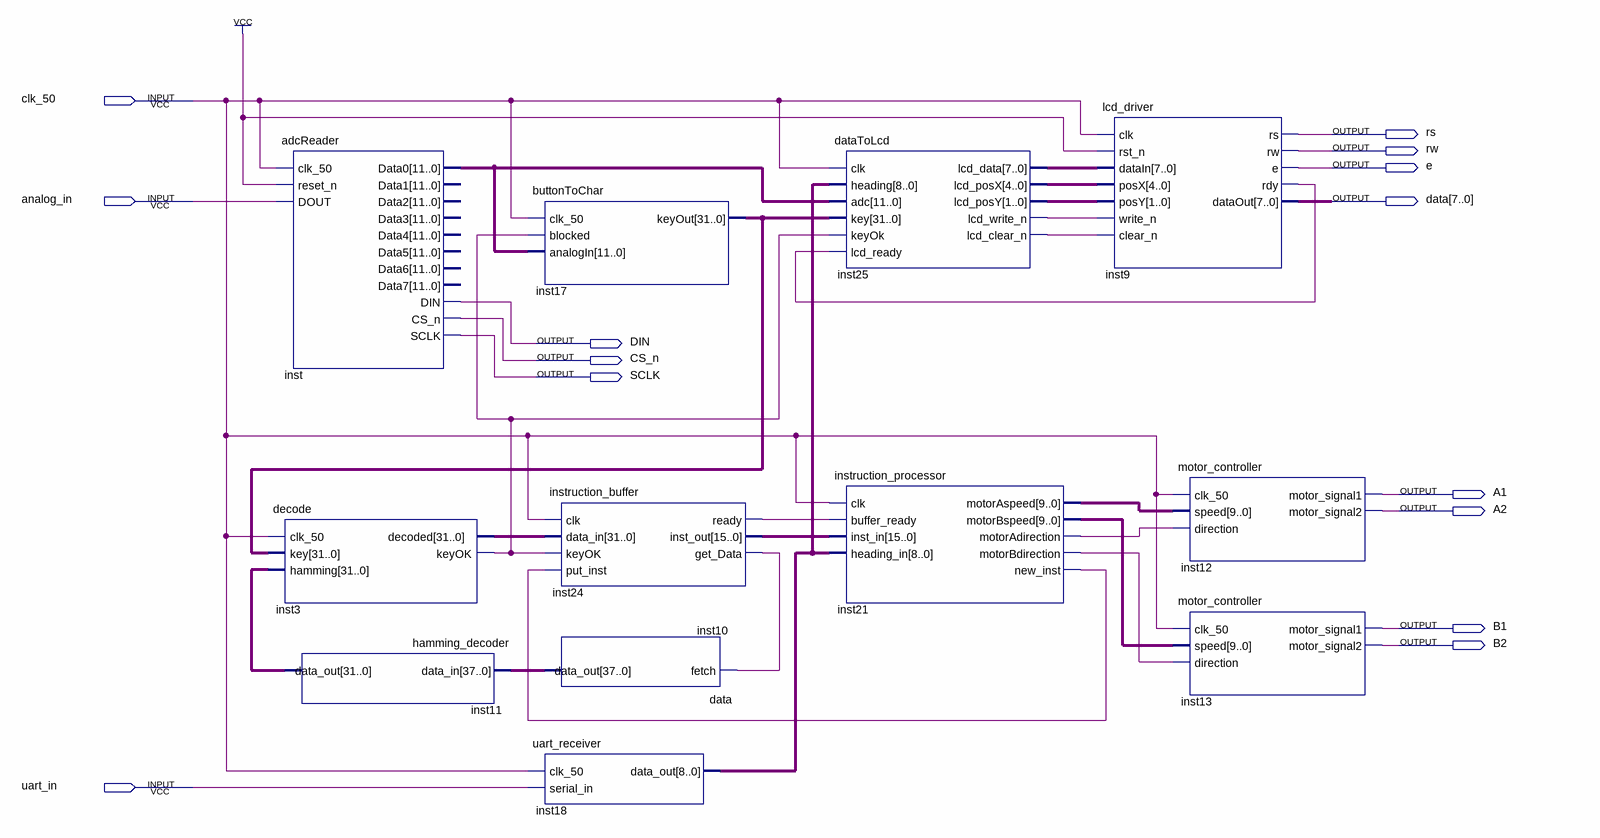
[diagram p0: schematic sheet]
// Quartus schematic Final.bdf as structural Verilog: 12 symbols, 14 pins
module Final (
  input  clk_50,
  input  analog_in,
  input  uart_in,
  output rs,
  output rw,
  output e,
  output [7:0] data,
  output DIN,
  output CS_n,
  output SCLK,
  output A1,
  output A2,
  output B1,
  output B2
);

  wire inst3_keyok, inst9_rdy, inst21_motoradirection, inst21_motorbdirection, inst21_new_inst,
       inst24_get_data, inst24_ready, inst25_lcd_clear_n, inst25_lcd_write_n;
  wire [1:0] inst25_lcd_posy;
  wire [4:0] inst25_lcd_posx;
  wire [7:0] inst25_lcd_data;
  wire [8:0] inst18_data_out;
  wire [9:0] inst21_motoraspeed, inst21_motorbspeed;
  wire [11:0] inst_data0;
  wire [15:0] inst24_inst_out;
  wire [31:0] inst3_decoded, inst11_data_out, inst17_keyout;
  wire [37:0] inst10_data_out;

  adcReader inst (
    .clk_50(clk_50), .reset_n(1'b1), .DOUT(analog_in), .Data0(inst_data0), .DIN(DIN), .CS_n(CS_n), .SCLK(SCLK));  // open: Data1, Data2, Data3, Data4, Data5, Data6, Data7
  decode inst3 (
    .clk_50(clk_50), .key(inst17_keyout), .hamming(inst11_data_out), .decoded(inst3_decoded),
    .keyOK(inst3_keyok));
  hamming_decoder inst11 (.data_in(inst10_data_out), .data_out(inst11_data_out));
  buttonToChar inst17 (.clk_50(clk_50), .blocked(inst3_keyok), .analogIn(inst_data0), .keyOut(inst17_keyout));
  instruction_buffer inst24 (
    .clk(clk_50), .data_in(inst3_decoded), .keyOK(inst3_keyok), .put_inst(inst21_new_inst),
    .ready(inst24_ready), .inst_out(inst24_inst_out), .get_Data(inst24_get_data));
  data inst10 (.fetch(inst24_get_data), .data_out(inst10_data_out));
  uart_receiver inst18 (.clk_50(clk_50), .serial_in(uart_in), .data_out(inst18_data_out));
  dataToLcd inst25 (
    .clk(clk_50), .heading(inst18_data_out), .adc(inst_data0), .key(inst17_keyout), .keyOk(inst3_keyok),
    .lcd_ready(inst9_rdy), .lcd_data(inst25_lcd_data), .lcd_posX(inst25_lcd_posx),
    .lcd_posY(inst25_lcd_posy), .lcd_write_n(inst25_lcd_write_n), .lcd_clear_n(inst25_lcd_clear_n));
  instruction_processor inst21 (
    .clk(clk_50), .buffer_ready(inst24_ready), .inst_in(inst24_inst_out), .heading_in(inst18_data_out),
    .motorAspeed(inst21_motoraspeed), .motorBspeed(inst21_motorbspeed),
    .motorAdirection(inst21_motoradirection), .motorBdirection(inst21_motorbdirection),
    .new_inst(inst21_new_inst));
  lcd_driver inst9 (
    .clk(clk_50), .rst_n(1'b1), .dataIn(inst25_lcd_data), .posX(inst25_lcd_posx), .posY(inst25_lcd_posy),
    .write_n(inst25_lcd_write_n), .clear_n(inst25_lcd_clear_n), .rs(rs), .rw(rw), .e(e), .rdy(inst9_rdy),
    .dataOut(data));
  motor_controller inst12 (
    .clk_50(clk_50), .speed(inst21_motoraspeed), .direction(inst21_motoradirection), .motor_signal1(A1),
    .motor_signal2(A2));
  motor_controller inst13 (
    .clk_50(clk_50), .speed(inst21_motorbspeed), .direction(inst21_motorbdirection), .motor_signal1(B1),
    .motor_signal2(B2));
endmodule
